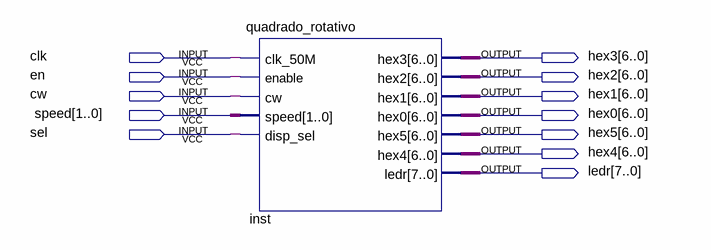
[diagram p0: schematic sheet]
// Quartus schematic top.bdf as structural Verilog: 1 symbols, 12 pins
module top (
  input  clk,
  input  en,
  input  cw,
  input  [1:0] speed,
  input  sel,
  output [6:0] hex3,
  output [6:0] hex2,
  output [6:0] hex1,
  output [6:0] hex0,
  output [6:0] hex5,
  output [6:0] hex4,
  output [7:0] ledr
);

  quadrado_rotativo inst (
    .clk_50M(clk), .enable(en), .cw(cw), .speed(speed), .disp_sel(sel), .hex3(hex3), .hex2(hex2),
    .hex1(hex1), .hex0(hex0), .hex5(hex5), .hex4(hex4), .ledr(ledr));
endmodule
